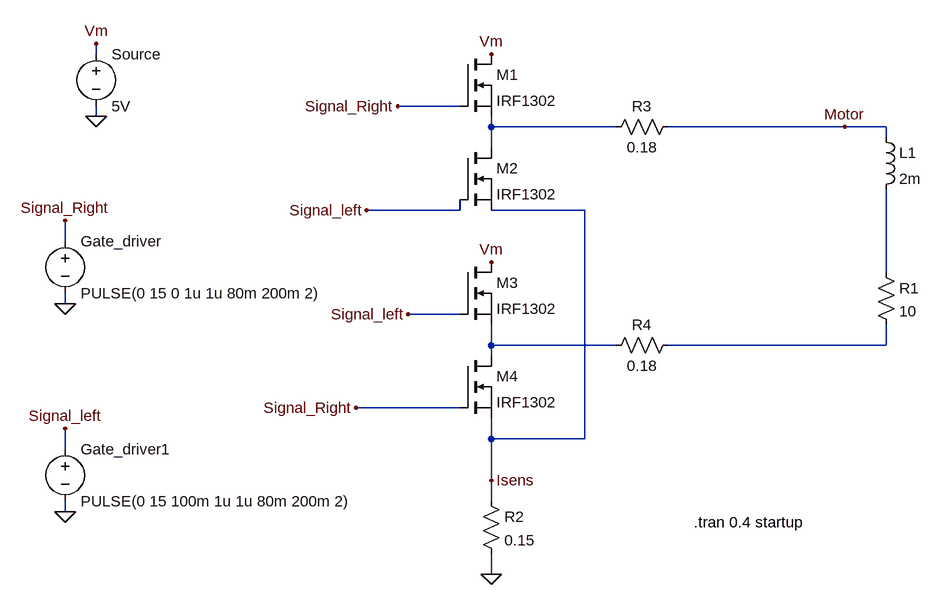
[diagram p0: schematic H_bridge.asc]
H_bridge.asc, the LTspice schematic file:
Version 4.1
SHEET 1 1840 772
WIRE -208 -48 -208 -64
WIRE 352 32 256 32
WIRE -208 48 -208 32
WIRE 400 64 400 48
WIRE 592 64 400 64
WIRE 944 64 672 64
WIRE 1008 64 944 64
WIRE 1008 80 1008 64
WIRE 400 96 400 64
WIRE 352 192 352 176
WIRE 352 192 208 192
WIRE 544 192 400 192
WIRE -256 240 -256 208
WIRE 1008 288 1008 160
WIRE -256 336 -256 320
WIRE 352 352 272 352
WIRE 400 400 400 368
WIRE 592 400 400 400
WIRE 1008 400 1008 368
WIRE 1008 400 672 400
WIRE 400 416 400 400
WIRE 352 496 192 496
WIRE 400 544 400 512
WIRE 544 544 544 192
WIRE 544 544 400 544
WIRE -256 560 -256 528
WIRE 400 608 400 544
WIRE 400 640 400 608
WIRE -256 656 -256 640
WIRE 400 752 400 720
FLAG 400 752 0
FLAG -208 -64 Vm
FLAG -208 48 0
FLAG 400 -48 Vm
FLAG 400 272 Vm
FLAG -256 336 0
FLAG -256 208 Signal_Right
FLAG -256 656 0
FLAG -256 528 Signal_left
FLAG 256 32 Signal_Right
FLAG 192 496 Signal_Right
FLAG 208 192 Signal_left
FLAG 272 352 Signal_left
FLAG 944 64 Motor
FLAG 400 608 Isens
SYMBOL nmos 352 -48 R0
SYMATTR InstName M1
SYMATTR Value IRF1302
SYMBOL nmos 352 96 R0
SYMATTR InstName M2
SYMATTR Value IRF1302
SYMBOL voltage -208 -64 R0
WINDOW 123 0 0 Left 0
WINDOW 39 0 0 Left 0
SYMATTR InstName Source
SYMATTR Value 5V
SYMBOL nmos 352 272 R0
SYMATTR InstName M3
SYMATTR Value IRF1302
SYMBOL nmos 352 416 R0
SYMATTR InstName M4
SYMATTR Value IRF1302
SYMBOL voltage -256 224 R0
WINDOW 123 0 0 Left 0
WINDOW 39 0 0 Left 0
SYMATTR InstName Gate_driver
SYMATTR Value PULSE(0 15 0 1u 1u 80m 200m 2)
SYMBOL ind 992 64 R0
SYMATTR InstName L1
SYMATTR Value 2m
SYMBOL res 384 624 R0
SYMATTR InstName R2
SYMATTR Value 0.15
SYMBOL voltage -256 544 R0
WINDOW 123 0 0 Left 0
WINDOW 39 0 0 Left 0
SYMATTR InstName Gate_driver1
SYMATTR Value PULSE(0 15 100m 1u 1u 80m 200m 2)
SYMBOL res 992 272 R0
SYMATTR InstName R1
SYMATTR Value 10
SYMBOL res 688 48 R90
WINDOW 0 0 56 VBottom 2
WINDOW 3 32 56 VTop 2
SYMATTR InstName R3
SYMATTR Value 0.18
SYMBOL res 688 384 R90
WINDOW 0 0 56 VBottom 2
WINDOW 3 32 56 VTop 2
SYMATTR InstName R4
SYMATTR Value 0.18
TEXT 712 672 Left 2 !.tran 0.4 startup

The netlist it stands for:
* H_bridge.asc
M1 Vm Signal_Right N001 N001 IRF1302
M2 N001 Signal_left Isens Isens IRF1302
V§Source Vm 0 5V
M3 Vm Signal_left N003 N003 IRF1302
M4 N003 Signal_Right Isens Isens IRF1302
V§Gate_driver Signal_Right 0 PULSE(0 15 0 1u 1u 80m 200m 2)
L1 Motor N002 2m
R2 Isens 0 0.15
V§Gate_driver1 Signal_left 0 PULSE(0 15 100m 1u 1u 80m 200m 2)
R1 N002 N004 10
R3 Motor N001 0.18
R4 N004 N003 0.18
.model NMOS NMOS
.model PMOS PMOS
.lib standard.mos
.tran 0.4 startup
.backanno
.end